# EAGLE design 2021_Annisa-Skripsi (EAGLE 9.6.2)
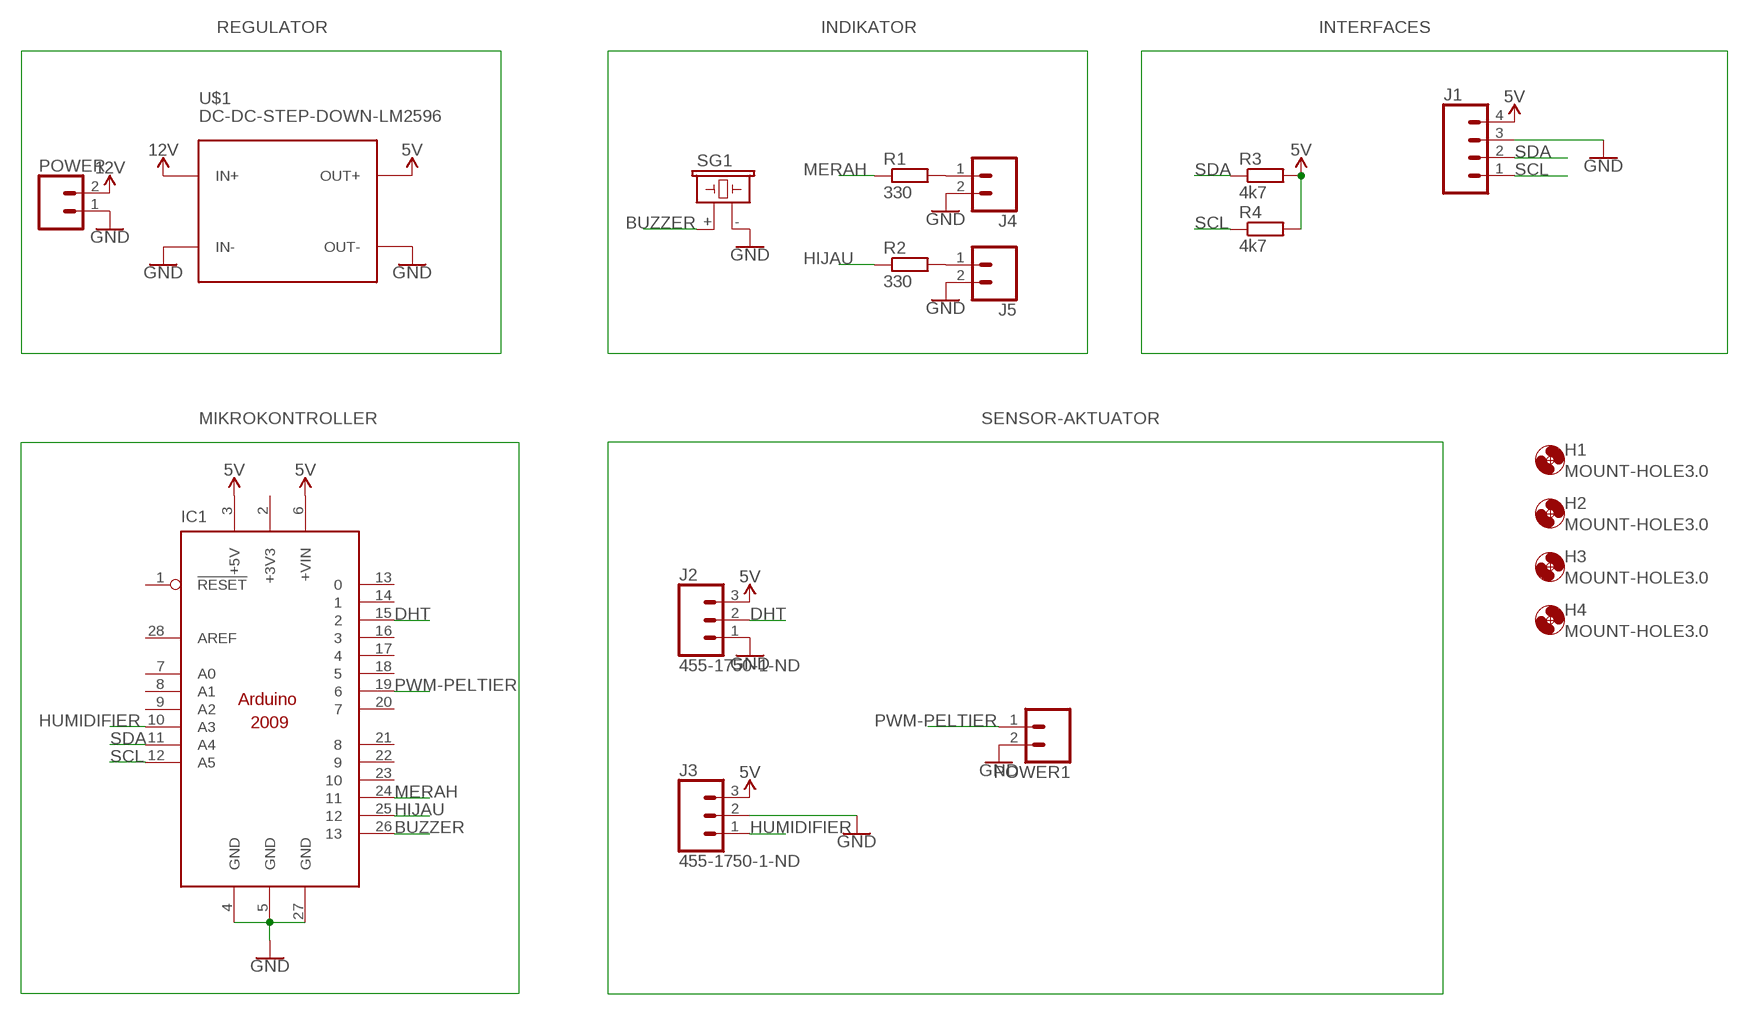
[diagram p0: schematic, sheet 1]

## Parts
H1  MOUNT-HOLE3.0  [3,0]
H2  MOUNT-HOLE3.0  [3,0]
H3  MOUNT-HOLE3.0  [3,0]
H4  MOUNT-HOLE3.0  [3,0]
IC1  ARDUINO2009_10  [ARDUINO2009]
J1  CONN_04PTH  [1X04]
J2  455-1750-1-ND  CONN_03  [1X03]
J3  455-1750-1-ND  CONN_03  [1X03]
J4  CONN_02  [1X02]
J5  CONN_02  [1X02]
POWER  CONN_025MM  [SCREWTERMINAL-5MM-2]
POWER1  CONN_025MM  [SCREWTERMINAL-5MM-2]
R1  330  R-EU_0207/7  [0207/7]
R2  330  R-EU_0207/7  [0207/7]
R3  4k7  R-EU_0207/7  [0207/7]
R4  4k7  R-EU_0207/7  [0207/7]
SG1  F/CM12P  [F/CM12P]
U$1  DC-DC-STEP-DOWN-LM2596  [DC-DC-STEP-DOWN-LM2596]

## Nets
5V: IC1.3(+5V) IC1.6(+VIN) J1.4 J2.3 J3.3 R3.2 R4.2 U$1.OUT+
12V: POWER.2 U$1.IN+
BUZZER: IC1.26 SG1.+
DHT: IC1.15 J2.2
GND: IC1.4(GND) IC1.5(GND) IC1.27(GND) J1.3 J2.1 J3.2 J4.2 J5.2 POWER1.2 POWER.1 SG1.- U$1.IN- U$1.OUT-
HIJAU: IC1.25 R2.1
HUMIDIFIER: IC1.10(A3) J3.1
MERAH: IC1.24 R1.1
N$1: J4.1 R1.2
N$2: J5.1 R2.2
PWM-PELTIER: IC1.19 POWER1.1
SCL: IC1.12(A5) J1.1 R4.1
SDA: IC1.11(A4) J1.2 R3.1
Unconnected: IC1.1(!RESET) IC1.7(A0) IC1.8(A1) IC1.9(A2) IC1.13 IC1.14 IC1.16 IC1.17 IC1.18 IC1.20 IC1.21 IC1.22 IC1.23 IC1.28(AREF)

## Power pins joined to a net without a drawn wire
+3V3: IC1.2(+3V3)

## Library data of the parts
H1-H4 = holes:MOUNT-HOLE: MOUNTING HOLE with drill center marker
IC1 = arduino:ARDUINO2009_1: The Arduino Duemilanove ("2009") is a microcontroller board based on the ATmega168 or ATmega328. - 14 digital input/output pins (of which 6 can be used as PWM outputs) - 6 analog inputs, a 16 MHz crystal oscillator - USB connection - power jack - ISP header - reset button It contains everything needed to support the microcontroller; simply connect it to a computer with a USB cable or power it with a AC-to-DC adapter or battery to get started http://arduino.cc/en/Main/ArduinoBoardDuemilanove
J1 = SparkFun-Connectors:CONN_04: Multi connection point. Often used as Generic Header-pin footprint for 0.1 inch spaced/style header connections On any of the 0.1 inch spaced packages, you can populate with these: Break Away Headers - Straight <https://www.sparkfun.com/products/116> (PRT-00116) Break Away Male Headers - Right Angle <https://www.sparkfun.com/products/553> (PRT-00553) Female Headers <https://www.sparkfun.com/products/115> (PRT-00115) Break Away Headers - Machine Pin <https://www.sparkfun.com/products/117> (PRT-00117) Break Away Female Headers - Swiss Machine Pin <https://www.sparkfun.com/products/743> (PRT-00743) For SCREWTERMINALS and SPRING TERMINALS visit here: Screw Terimnals on SparkFun.com <https://www.sparkfun.com/search/results?term=Screw+Terminals> (5mm/3.5mm/2.54mm spacing) This device is also useful as a general connection point to wire up your design to another part of your project. Our various solder wires solder well into these plated through hole pads. Hook-Up Wire - Assortment (Stranded, 22 AWG) <https://www.sparkfun.com/products/11375> (PRT-11375) Hook-Up Wire - Assortment (Solid Core, 22 AWG) <https://www.sparkfun.com/products/11367> (PRT-11367) View the entire wire category on our website here <https://www.sparkfun.com/categories/141> Special notes: Molex polarized connector foot print use with SKU : PRT-08231 with associated crimp pins and housings. 1MM SMD Version SKU: PRT-10208; PROD_ID: CONN-09696
J2 J3 = SparkFun-Connectors:CONN_03: Multi connection point. Often used as Generic Header-pin footprint for 0.1 inch spaced/style header connections On any of the 0.1 inch spaced packages, you can populate with these: Break Away Headers - Straight <https://www.sparkfun.com/products/116> (PRT-00116) Break Away Male Headers - Right Angle <https://www.sparkfun.com/products/553> (PRT-00553) Female Headers <https://www.sparkfun.com/products/115> (PRT-00115) Break Away Headers - Machine Pin <https://www.sparkfun.com/products/117> (PRT-00117) Break Away Female Headers - Swiss Machine Pin <https://www.sparkfun.com/products/743> (PRT-00743) Stackable Header - 3 Pin (Female, 0.1") <https://www.sparkfun.com/products/13875> (PRT-13875) For SCREWTERMINALS and SPRING TERMINALS visit here: Screw Terimnals on SparkFun.com <https://www.sparkfun.com/search/results?term=Screw+Terminals> (5mm/3.5mm/2.54mm spacing) This device is also useful as a general connection point to wire up your design to another part of your project. Our various solder wires solder well into these plated through hole pads. Hook-Up Wire - Assortment (Stranded, 22 AWG) <https://www.sparkfun.com/products/11375> (PRT-11375) Hook-Up Wire - Assortment (Solid Core, 22 AWG) <https://www.sparkfun.com/products/11367> (PRT-11367) View the entire wire category on our website here <https://www.sparkfun.com/categories/141> Special notes: Molex polarized connector foot print use with SKU : PRT-08232 with associated crimp pins and housings.; PROD_ID: XXX-00000
J4 J5 = SparkFun-Connectors:CONN_02: Multi connection point. Often used as Generic Header-pin footprint for 0.1 inch spaced/style header connections On any of the 0.1 inch spaced packages, you can populate with these: Break Away Headers - Straight <https://www.sparkfun.com/products/116> (PRT-00116) Break Away Male Headers - Right Angle <https://www.sparkfun.com/products/553> (PRT-00553) Female Headers <https://www.sparkfun.com/products/115> (PRT-00115) Break Away Headers - Machine Pin <https://www.sparkfun.com/products/117> (PRT-00117) Break Away Female Headers - Swiss Machine Pin <https://www.sparkfun.com/products/743> (PRT-00743) For SCREWTERMINALS and SPRING TERMINALS visit here: Screw Terimnals on SparkFun.com <https://www.sparkfun.com/search/results?term=Screw+Terminals> (5mm/3.5mm/2.54mm spacing) This device is also useful as a general connection point to wire up your design to another part of your project. Our various solder wires solder well into these plated through hole pads. Hook-Up Wire - Assortment (Stranded, 22 AWG) <https://www.sparkfun.com/products/11375> (PRT-11375) Hook-Up Wire - Assortment (Solid Core, 22 AWG) <https://www.sparkfun.com/products/11367> (PRT-11367) View the entire wire category on our website here <https://www.sparkfun.com/categories/141> Special notes: Molex polarized connector foot print use with: PRT-08233 with associated crimp pins and housings. 2.54_SCREWTERM for use with PRT-10571. 3.5mm Screw Terminal footprints for PRT-08084 5mm Screw Terminal footprints for use with PRT-08432
POWER POWER1 = SparkFun-Connectors:CONN_02: Multi connection point. Often used as Generic Header-pin footprint for 0.1 inch spaced/style header connections On any of the 0.1 inch spaced packages, you can populate with these: Break Away Headers - Straight <https://www.sparkfun.com/products/116> (PRT-00116) Break Away Male Headers - Right Angle <https://www.sparkfun.com/products/553> (PRT-00553) Female Headers <https://www.sparkfun.com/products/115> (PRT-00115) Break Away Headers - Machine Pin <https://www.sparkfun.com/products/117> (PRT-00117) Break Away Female Headers - Swiss Machine Pin <https://www.sparkfun.com/products/743> (PRT-00743) For SCREWTERMINALS and SPRING TERMINALS visit here: Screw Terimnals on SparkFun.com <https://www.sparkfun.com/search/results?term=Screw+Terminals> (5mm/3.5mm/2.54mm spacing) This device is also useful as a general connection point to wire up your design to another part of your project. Our various solder wires solder well into these plated through hole pads. Hook-Up Wire - Assortment (Stranded, 22 AWG) <https://www.sparkfun.com/products/11375> (PRT-11375) Hook-Up Wire - Assortment (Solid Core, 22 AWG) <https://www.sparkfun.com/products/11367> (PRT-11367) View the entire wire category on our website here <https://www.sparkfun.com/categories/141> Special notes: Molex polarized connector foot print use with: PRT-08233 with associated crimp pins and housings. 2.54_SCREWTERM for use with PRT-10571. 3.5mm Screw Terminal footprints for PRT-08084 5mm Screw Terminal footprints for use with PRT-08432; SF_SKU: PRT-08432
R1-R4 = rcl:R-EU_: RESISTOR, European symbol; SPICEPREFIX: R
SG1 = buzzer:F/CM12P: BUZZER Source: Buerklin; OC_FARNELL: unknown; OC_NEWARK: unknown
U$1 = 0.96inch OLED:DC-DC-STEP-DOWN-LM2596: DC/DC Step-Down Regulator based on LM2596-ADJ chip LM2596 datasheet available here: http://www.ti.com/lit/ds/symlink/lm2596.pdf Click here to find device on ebay.com <http://www.ebay.com/sch/lm2596+power+regulator>

## Board
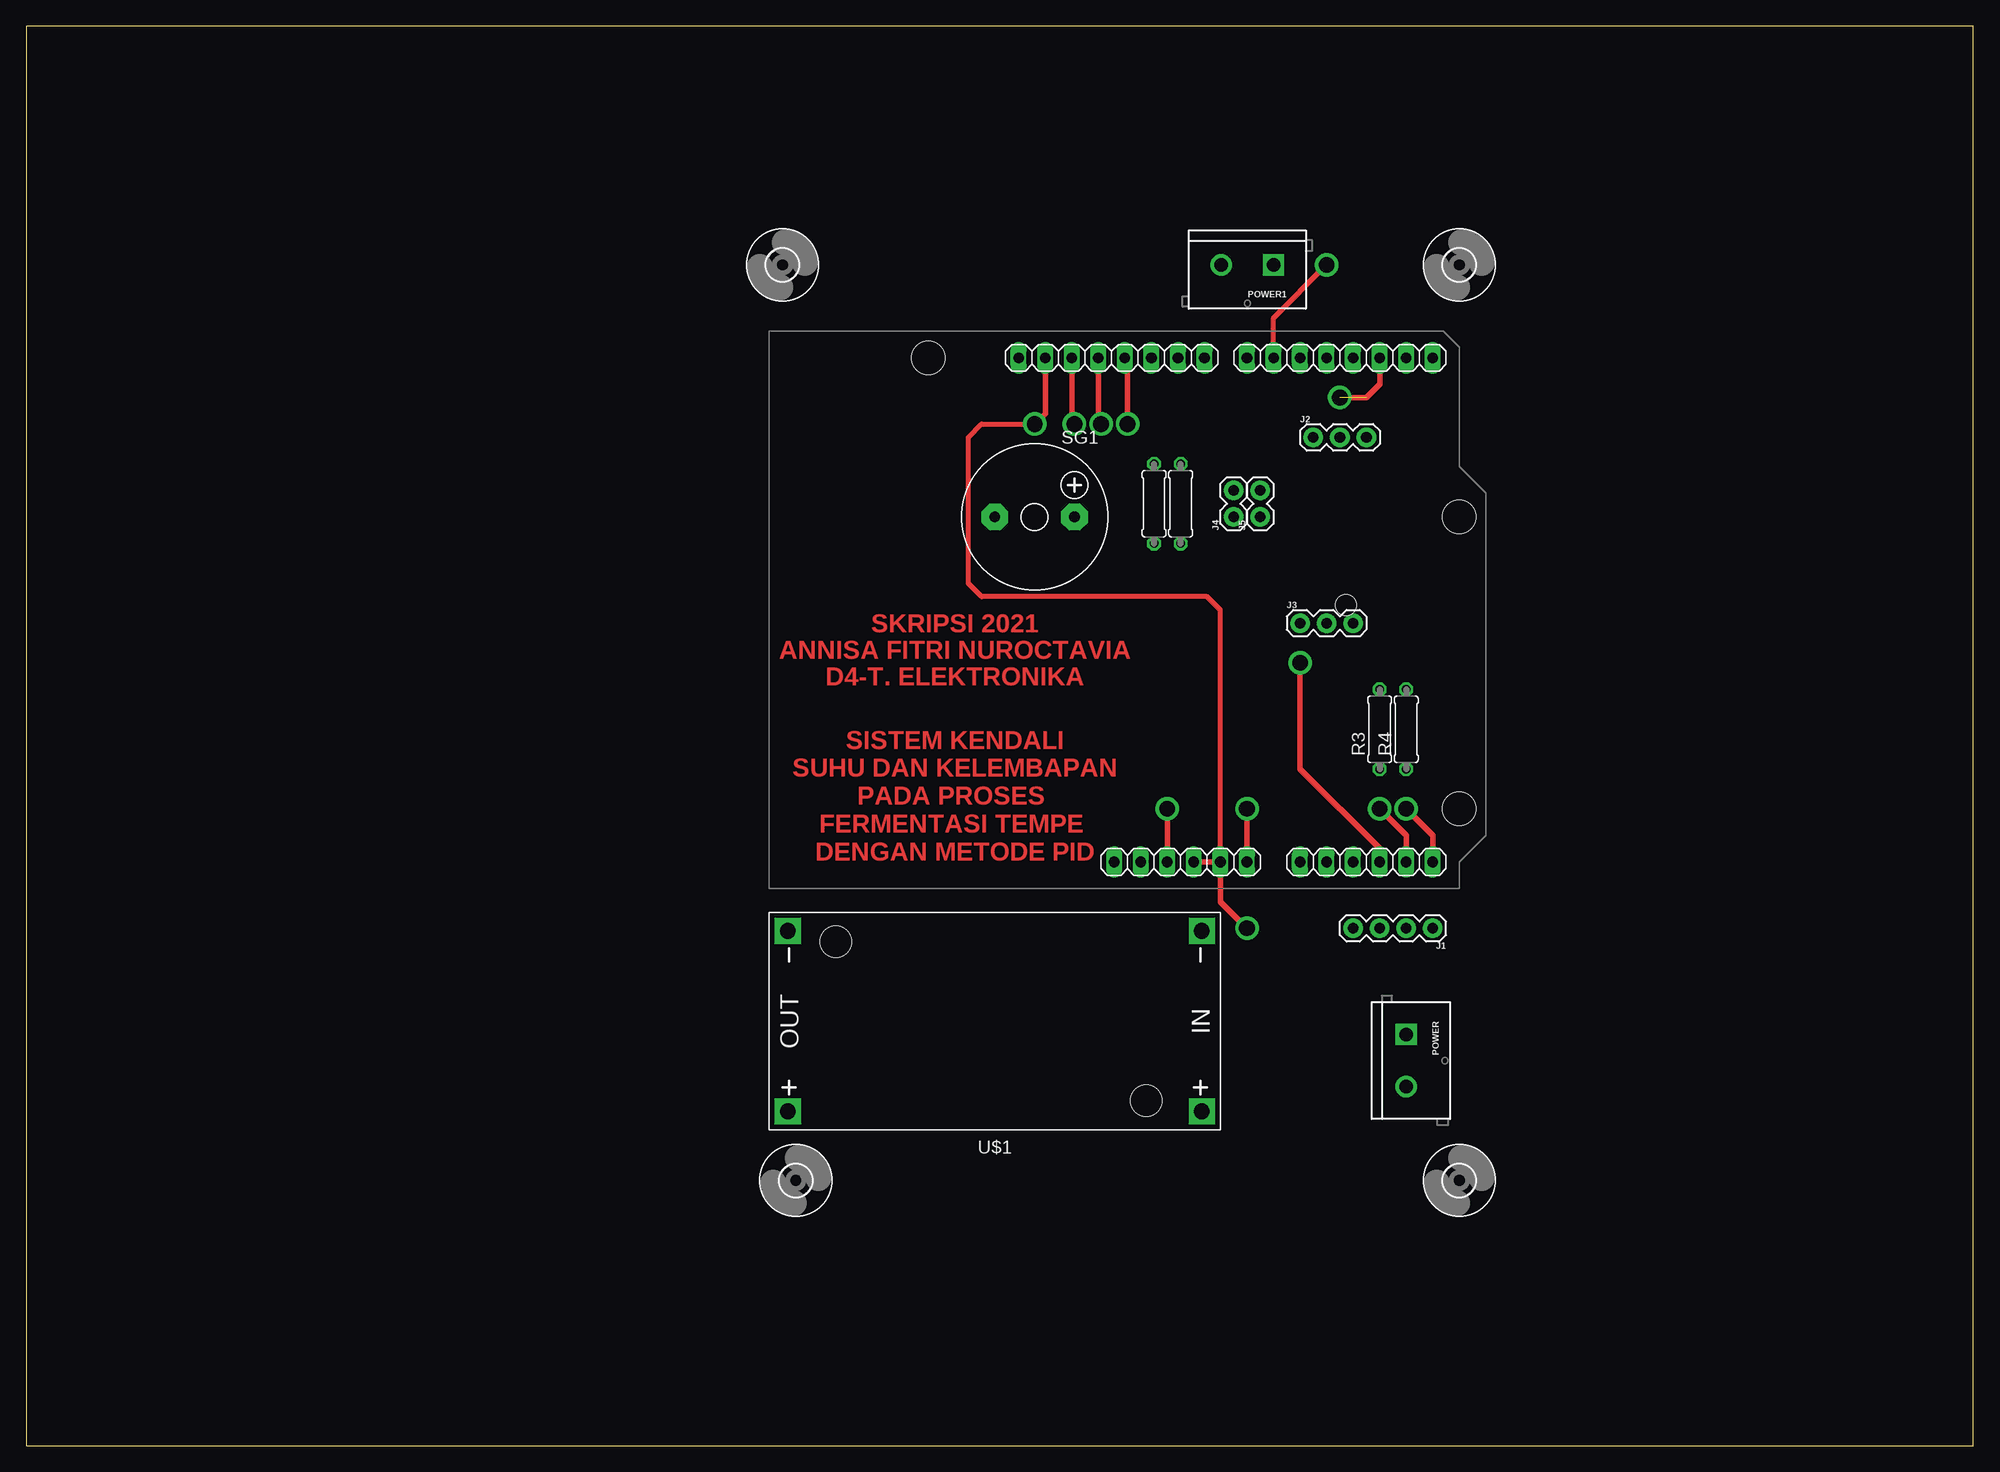
[diagram p1: board, top side]
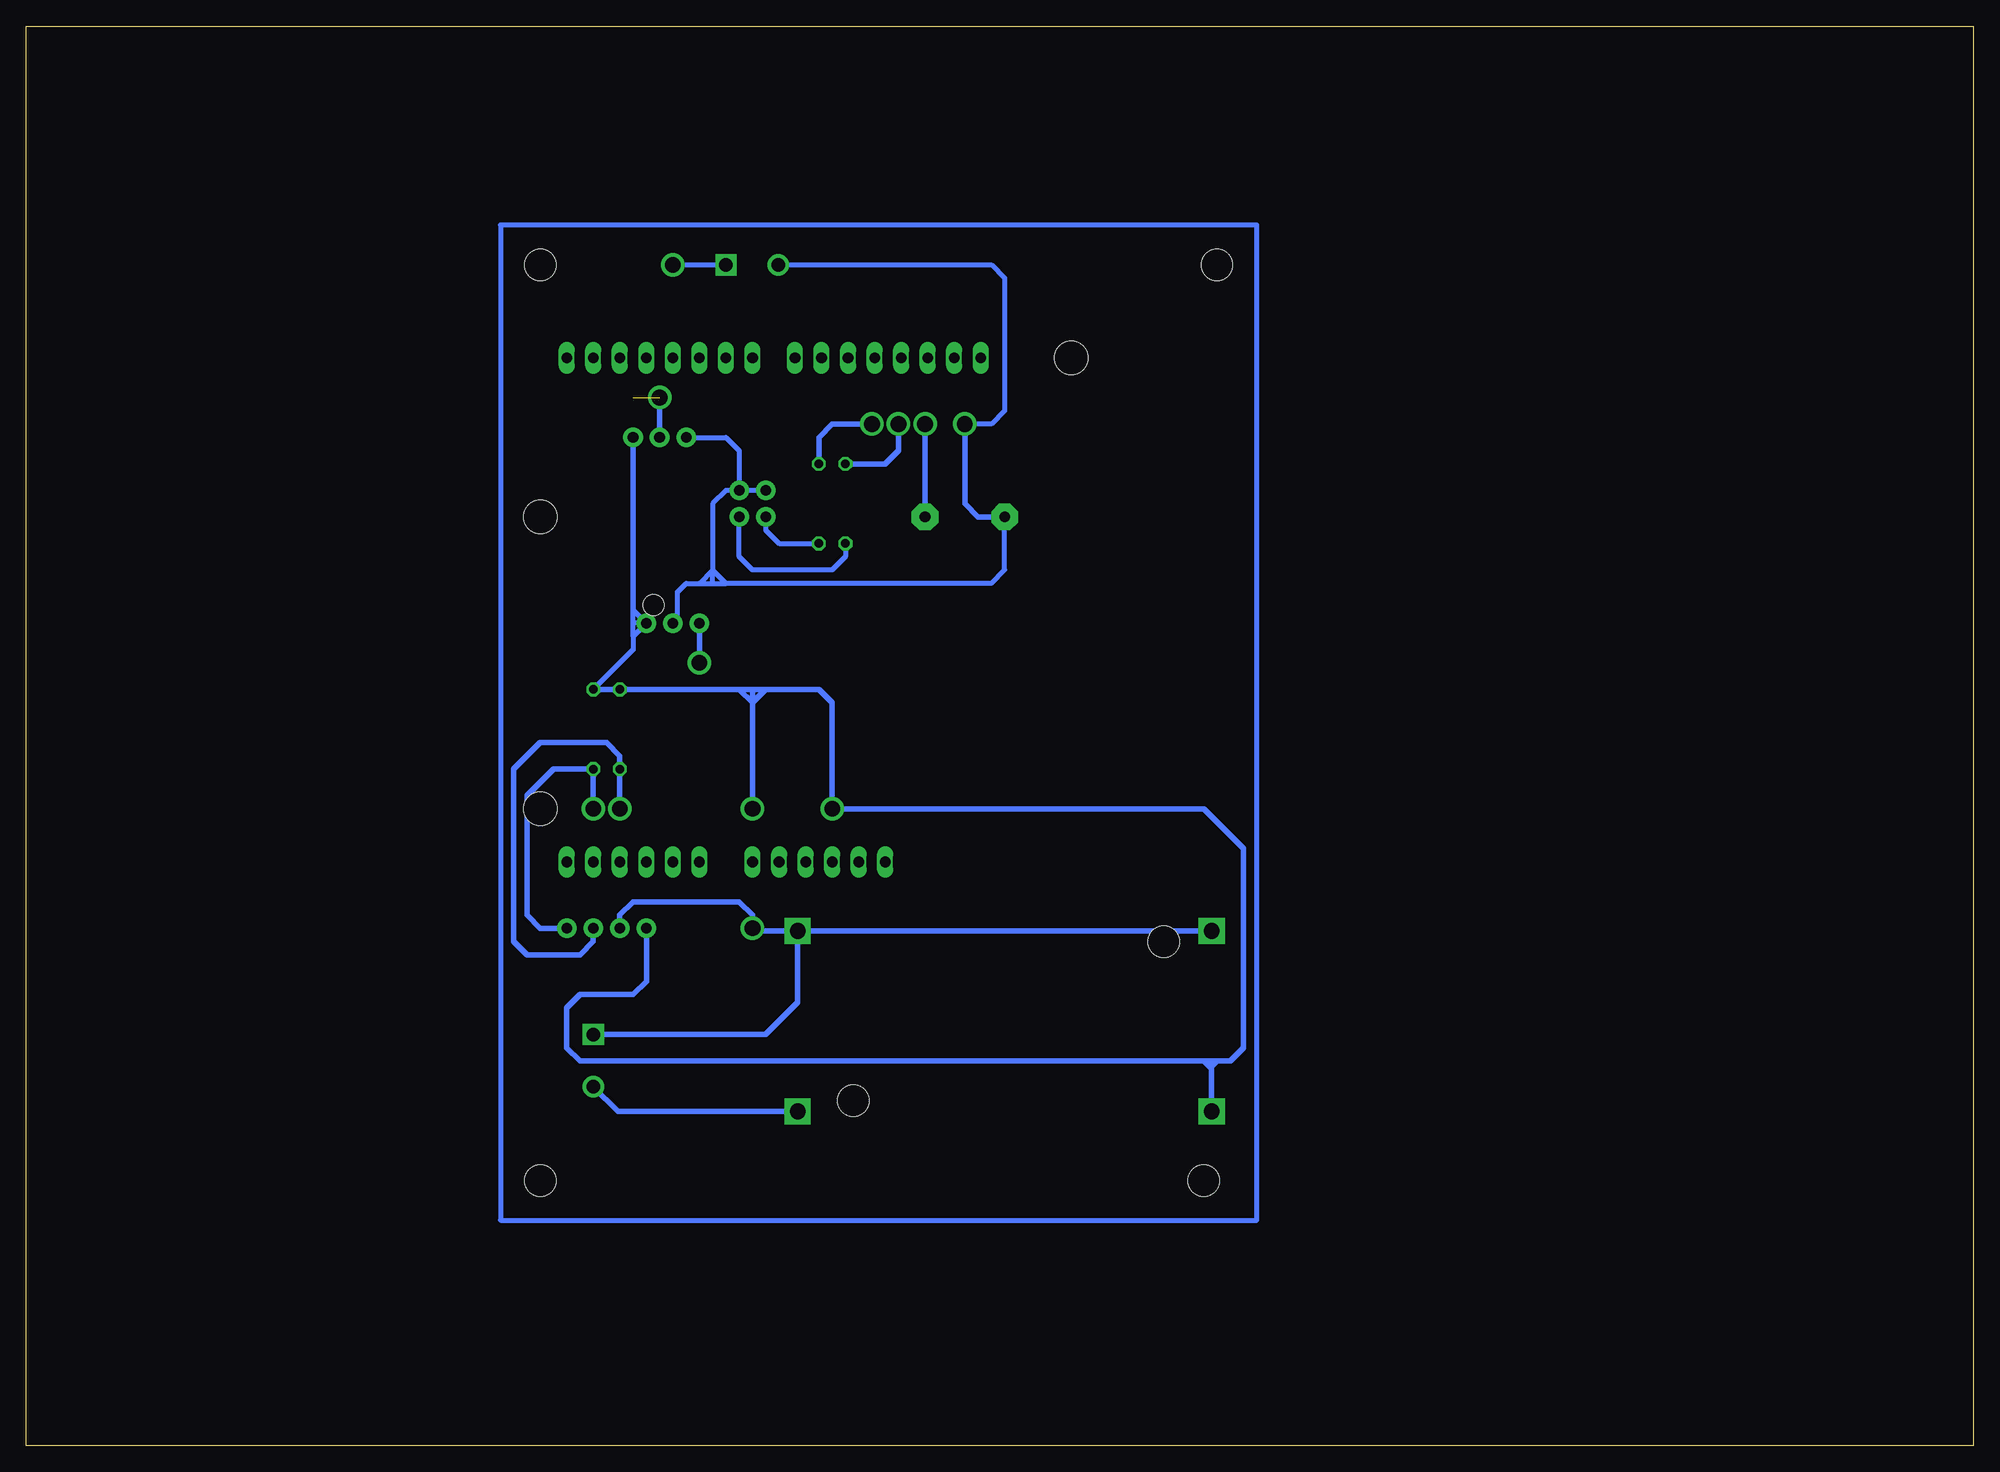
[diagram p2: board, bottom side, seen from below]

Size 186.36 x 135.88 mm. Coordinates in mm from the lower left corner, seen from the top.
Outline: 0,0 186.36,0 186.36,135.88 0,135.88 0,0
Copper layers (1*16): Top 0.035mm / dielectric 1.5mm / Bottom 0.035mm
Design rules "default": minimum track width 6mil, minimum drill 0.35mm, track to track 6mil, track to pad 6mil, pad to pad 6mil, via to via 6mil, smd to smd 6mil, copper to edge 40mil, drill to drill 6mil, minimum pad ring 10mil, minimum via ring 8mil, stop-mask expansion 4mil, vias tented up to drill 0mil, thermal gap 10mil

### Footprints (pad centres in the part's own frame; a part is rotated, then mirrored left to right if it is on the bottom)
3,0 = hole 3: 0,0
ARDUINO2009 = drill 1.016 long: 1 33.02,2.54; 2 35.56,2.54; 3 38.1,2.54; 4 40.64,2.54; 5 43.18,2.54; 6 45.72,2.54; 7 50.8,2.54; 8 53.34,2.54; 9 55.88,2.54; 10 58.42,2.54; 11 60.96,2.54; 12 63.5,2.54; 13 63.5,50.8; 14 60.96,50.8; 15 58.42,50.8; 16 55.88,50.8; 17 53.34,50.8; 18 50.8,50.8; 19 48.26,50.8; 20 45.72,50.8; 21 41.656,50.8; 22 39.116,50.8; 23 36.576,50.8; 24 34.036,50.8; 25 31.496,50.8; 26 28.956,50.8; 27 26.416,50.8; 28 23.876,50.8 | hole 3.2: 15.24,50.8; 66.04,35.56; 66.04,7.62 | hole 2: 55.17,27.114
1X04 = drill 1.016 pad 1.88: 1 0,0; 2 2.54,0; 3 5.08,0; 4 7.62,0
1X03 = drill 1.016 pad 1.88: 1 0,0; 2 2.54,0; 3 5.08,0
1X02 = drill 1.016 pad 1.88: 1 0,0; 2 2.54,0
SCREWTERMINAL-5MM-2 = drill 1.3 pad 2.032 square: 1 0,0 | drill 1.3 pad 2.032: 2 5,0
0207/7 = drill 0.813 octagon: 1 -3.81,0; 2 3.81,0
F/CM12P = drill 1.016 pad 2.54 octagon: + 3.81,0; - -3.81,0
DC-DC-STEP-DOWN-LM2596 = drill 1.5 pad 2.5 square: IN+ -19.812,8.636; IN- -19.812,-8.636; OUT+ 19.812,8.636; OUT- 19.812,-8.636 | hole 3: -14.478,7.62; 15.24,-7.62

### Placement (x,y rotation side)
H1  73.66,25.4 0 top
H2  72.39,113.03 0 top
H3  137.16,113.03 0 top
H4  137.16,25.4 0 top
IC1  71.12,53.34 0 top
J1  134.62,49.53 180 top
J2  123.19,96.52 0 top
J3  121.92,78.74 0 top
J4  115.57,88.9 90 top
J5  118.11,88.9 90 top
POWER  132.08,39.37 270 top
POWER1  119.38,113.03 180 top
R1  110.49,90.17 270 top
R2  107.95,90.17 270 top
R3  129.54,68.58 90 top
R4  132.08,68.58 90 top
SG1  96.52,88.9 0 top
U$1  92.71,40.64 180 top

### Tracks (layer width: path | path; a pad name or v marks a point on that pad's centre or on a via)
5V  (via drill 1.5)
  Top 0.508: IC1.6 v116.84,60.96 | v109.22,60.96 IC1.3
  Bottom 0.5: R4.2 128.27,76.2 128.27,77.47 | 128.27,77.47 128.27,78.74 | 128.27,78.74 128.27,80.01 | 128.27,78.74 J3.3 128.27,77.47
  Bottom 0.508: R4.2 R3.2 118.11,72.39 | 118.11,72.39 116.84,71.12 | 116.84,72.39 116.84,71.12 | 116.84,71.12 115.57,72.39 | 115.57,72.39 110.49,72.39 109.22,71.12 v109.22,60.96 73.66,60.96 69.85,57.15 69.85,38.1 71.12,36.83 72.39,36.83 | 115.57,72.39 118.11,72.39 | v116.84,60.96 116.84,71.12 | 72.9,36.07 72.9,36.32 | 73.66,36.83 133.35,36.83 134.62,38.1 134.62,41.91 133.35,43.18 128.27,43.18 127,44.45 J1.4 | 72.9,36.07 U$1.OUT+ | J2.3 128.27,80.01 J3.3 | 72.39,36.83 73.66,36.83 | 72.9,36.07 73.03,36.2 | 73.03,36.2 73.66,36.83 | 73.03,36.2 72.39,36.83
12V
  Bottom 0.508: POWER.2 129.71,32 U$1.IN+
BUZZER  (via drill 1.5)
  Top 0.508: IC1.26 100.08,98.04 v100.33,97.79
  Bottom 0.508: v100.33,97.79 SG1.+
DHT  (via drill 1.5)  (1 unrouted)
  Top 0.508: IC1.15 129.54,101.6 128.27,100.33 v125.73,100.33
  Bottom 0.508: v125.73,100.33 J2.2
GND  (via drill 1.5)
  Top 0.5: v96.52,97.79 91.44,97.79 90.17,96.52 90.17,82.55 91.44,81.28 113.03,81.28 114.3,80.01 IC1.5
  Top 0.508: IC1.27 97.54,98.81 v96.52,97.79 | IC1.4 IC1.5 114.3,52.07 v116.84,49.53
  Bottom 0.5: J4.2 J5.2 | J2.1 119.38,96.52 118.11,95.25 J5.2 | POWER1.2 93.98,113.03 92.71,111.76 92.71,99.06 93.98,97.79 v96.52,97.79 | J5.2 119.38,91.44 120.65,90.17 120.65,83.82 | 119.38,82.55 93.98,82.55 92.71,83.82 SG1.- | J3.2 124.46,79.08 124.02,79.52 124.02,81.72 123.19,82.55 121.92,82.55 | 120.65,83.82 119.38,82.55 | 121.92,82.55 120.65,82.55 | 120.65,82.55 119.38,82.55 | 120.65,82.55 120.65,83.82 | 120.65,83.82 121.92,82.55
  Bottom 0.508: SG1.- 95.25,88.9 96.52,90.17 v96.52,97.79 | POWER.1 115.57,39.37 112.52,42.42 U$1.IN- | U$1.OUT- U$1.IN- | U$1.IN- 116.59,49.28 v116.84,49.53 116.84,50.8 118.11,52.07 128.27,52.07 129.54,50.8 J1.3
HIJAU  (via drill 1.5)
  Top 0.508: v102.87,97.79 102.62,98.04 IC1.25
  Bottom 0.508: R2.1 104.14,93.98 102.87,95.25 v102.87,97.79
HUMIDIFIER  (via drill 1.5)
  Top 0.508: IC1.10 129.54,57.15 121.92,64.77 v121.92,74.93
  Bottom 0.508: v121.92,74.93 J3.1
MERAH  (via drill 1.5)
  Top 0.508: IC1.24 105.41,103.89 v105.41,97.79
  Bottom 0.508: v105.41,97.79 109.22,97.79 110.49,96.52 R1.1
N$1
  Bottom 0.5: J4.1 115.57,87.63 114.3,86.36 R1.2
N$2
  Bottom 0.5: R2.2 107.95,85.09 109.22,83.82 116.84,83.82 118.11,85.09 J5.1
N$3
  Bottom 0.5: 68.58,116.84 140.97,116.84 140.97,21.59 68.58,21.59 68.58,116.84
PWM-PELTIER  (via drill 1.5)
  Top 0.5: v124.46,113.03 119.38,107.95 IC1.19
  Bottom 0.5: v124.46,113.03 POWER1.1
SCL  (via drill 1.5)
  Top 0.508: IC1.12 134.62,58.42 v132.08,60.96
  Bottom 0.508: v132.08,60.96 R4.1 135.89,64.77 138.43,62.23 138.43,50.8 137.16,49.53 J1.1
SDA  (via drill 1.5)
  Top 0.508: v129.54,60.96 132.08,58.42 IC1.11
  Bottom 0.508: v129.54,60.96 R3.1 129.54,66.04 130.81,67.31 137.16,67.31 139.7,64.77 139.7,48.26 138.43,46.99 133.35,46.99 132.08,48.26 J1.2

### Text on the board
Top: SKRIPSI 2021 | ANNISA FITRI NUROCTAVIA | D4-T. ELEKTRONIKA | SISTEM KENDALI / SUHU DAN KELEMBAPAN / PADA PROSES / FERMENTASI TEMPE / DENGAN METODE PID